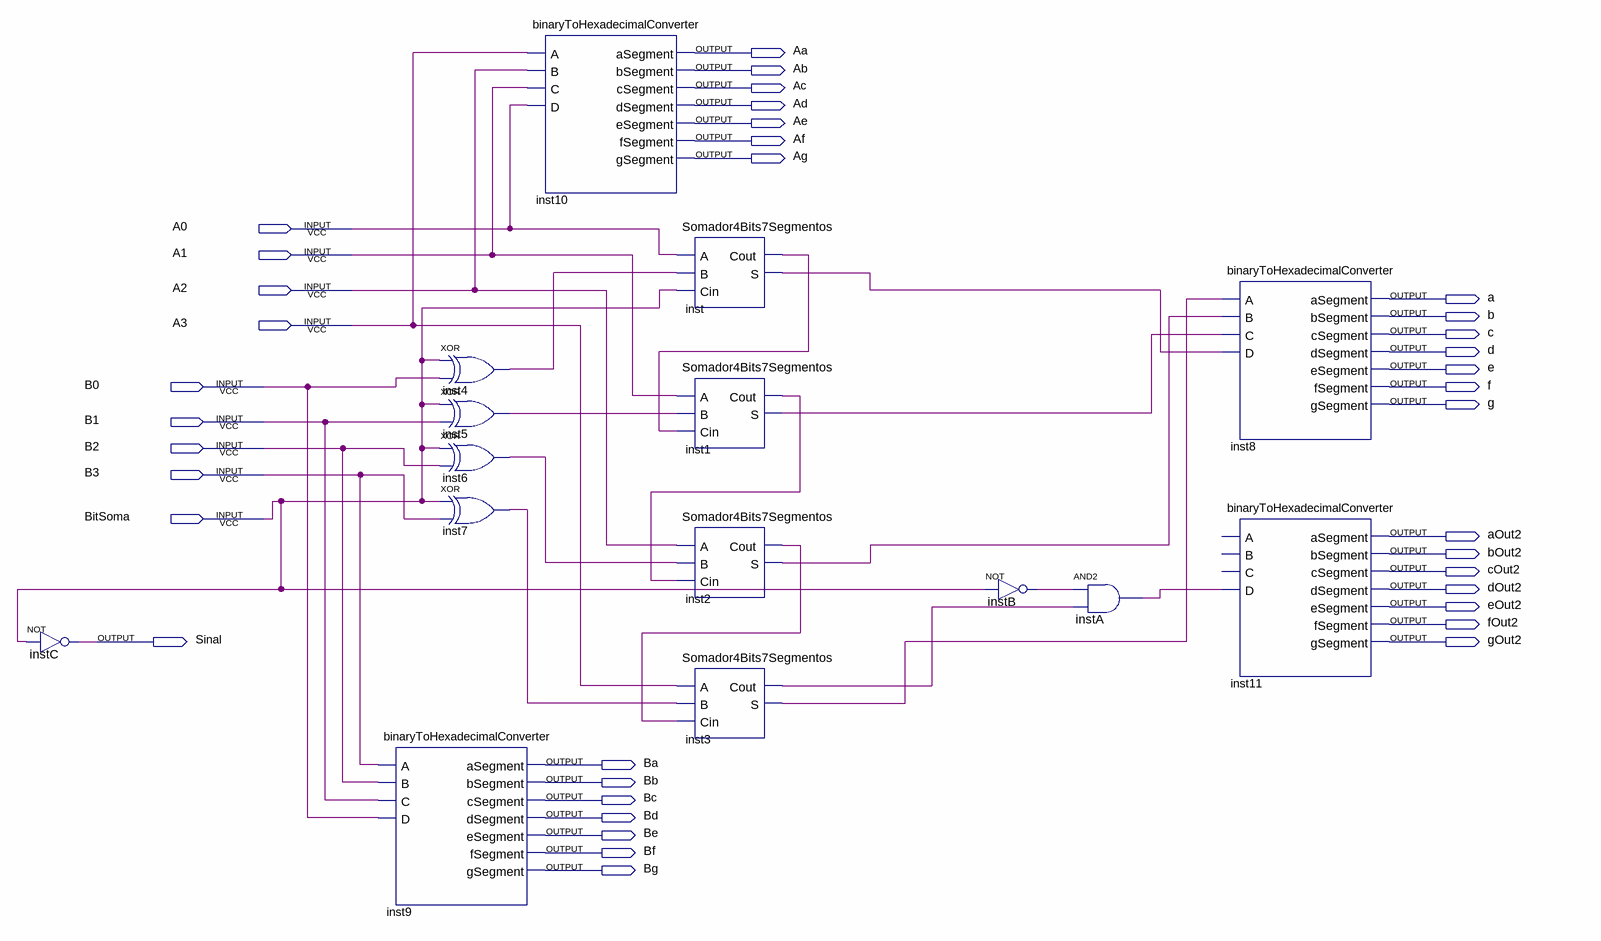
[diagram p0: schematic sheet]
// Quartus schematic Somador4BitsGrande.bdf as structural Verilog: 15 symbols, 38 pins
module Somador4BitsGrande (
  input  A0,
  input  A1,
  input  A2,
  input  A3,
  input  B0,
  input  B1,
  input  B2,
  input  B3,
  input  BitSoma,
  output Aa,
  output Ab,
  output Ac,
  output Ad,
  output Ae,
  output Af,
  output Ag,
  output a,
  output b,
  output c,
  output d,
  output e,
  output f,
  output g,
  output aOut2,
  output bOut2,
  output cOut2,
  output dOut2,
  output eOut2,
  output fOut2,
  output Sinal,
  output gOut2,
  output Ba,
  output Bb,
  output Bc,
  output Bd,
  output Be,
  output Bf,
  output Bg
);

  wire inst1_cout, inst1_s, inst2_cout, inst2_s, inst3_cout, inst3_s, inst4_out, inst5_out, inst6_out,
       inst7_out, inst_cout, inst_s, instA_out, instB_out;

  not instC (Sinal, BitSoma);
  binaryToHexadecimalConverter inst9 (
    .A(B3), .B(B2), .C(B1), .D(B0), .aSegment(Ba), .bSegment(Bb), .cSegment(Bc), .dSegment(Bd),
    .eSegment(Be), .fSegment(Bf), .gSegment(Bg));
  xor inst4 (inst4_out, BitSoma, B0);
  xor inst5 (inst5_out, BitSoma, B1);
  xor inst6 (inst6_out, BitSoma, B2);
  xor inst7 (inst7_out, BitSoma, B3);
  binaryToHexadecimalConverter inst10 (
    .A(A3), .B(A2), .C(A1), .D(A0), .aSegment(Aa), .bSegment(Ab), .cSegment(Ac), .dSegment(Ad),
    .eSegment(Ae), .fSegment(Af), .gSegment(Ag));
  Somador4Bits7Segmentos inst (.A(A0), .B(inst4_out), .Cin(BitSoma), .Cout(inst_cout), .S(inst_s));
  Somador4Bits7Segmentos inst1 (.A(A1), .B(inst5_out), .Cin(inst_cout), .Cout(inst1_cout), .S(inst1_s));
  Somador4Bits7Segmentos inst2 (.A(A2), .B(inst6_out), .Cin(inst1_cout), .Cout(inst2_cout), .S(inst2_s));
  Somador4Bits7Segmentos inst3 (.A(A3), .B(inst7_out), .Cin(inst2_cout), .Cout(inst3_cout), .S(inst3_s));
  not instB (instB_out, BitSoma);
  and instA (instA_out, instB_out, inst3_cout);
  binaryToHexadecimalConverter inst8 (
    .A(inst3_s), .B(inst2_s), .C(inst1_s), .D(inst_s), .aSegment(a), .bSegment(b), .cSegment(c),
    .dSegment(d), .eSegment(e), .fSegment(f), .gSegment(g));
  binaryToHexadecimalConverter inst11 (
    .D(instA_out), .aSegment(aOut2), .bSegment(bOut2), .cSegment(cOut2), .dSegment(dOut2), .eSegment(eOut2),
    .fSegment(fOut2), .gSegment(gOut2));  // open: A, B, C
endmodule
